# EAGLE design LoadCell-Board (EAGLE 9.6.2)
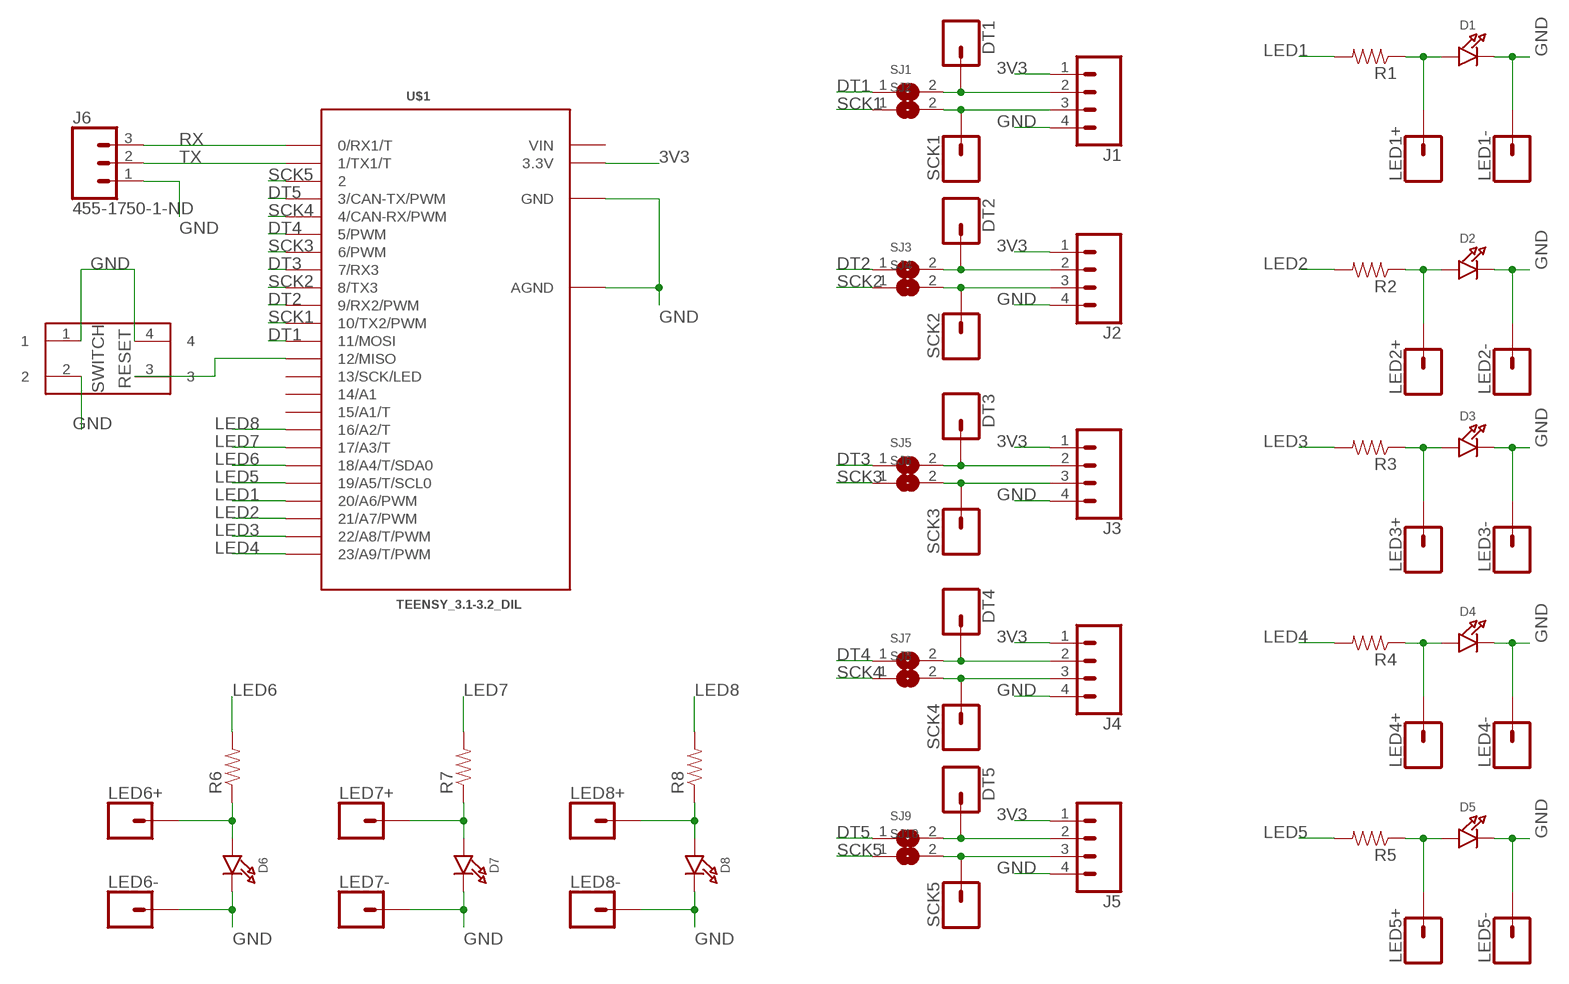
[diagram p0: schematic, sheet 1]

## Parts
D1  MICROBUILDER_LED0603  [MICROBUILDER_CHIPLED_0603]
D2  MICROBUILDER_LED0603  [MICROBUILDER_CHIPLED_0603]
D3  MICROBUILDER_LED0603  [MICROBUILDER_CHIPLED_0603]
D4  MICROBUILDER_LED0603  [MICROBUILDER_CHIPLED_0603]
D5  MICROBUILDER_LED0603  [MICROBUILDER_CHIPLED_0603]
D6  MICROBUILDER_LED0603  [MICROBUILDER_CHIPLED_0603]
D7  MICROBUILDER_LED0603  [MICROBUILDER_CHIPLED_0603]
D8  MICROBUILDER_LED0603  [MICROBUILDER_CHIPLED_0603]
DT1  CONN_01  [1X01]
DT2  CONN_01  [1X01]
DT3  CONN_01  [1X01]
DT4  CONN_01  [1X01]
DT5  CONN_01  [1X01]
J1  CONN_041X04_NO_SILK  [1X04_NO_SILK]
J2  CONN_041X04_NO_SILK  [1X04_NO_SILK]
J3  CONN_041X04_NO_SILK  [1X04_NO_SILK]
J4  CONN_041X04_NO_SILK  [1X04_NO_SILK]
J5  CONN_041X04_NO_SILK  [1X04_NO_SILK]
J6  455-1750-1-ND  CONN_03  [1X03]
LED1+  CONN_01PTH_NO_SILK_YES_STOP  [1X01_NO_SILK]
LED1-  CONN_01PTH_NO_SILK_YES_STOP  [1X01_NO_SILK]
LED2+  CONN_01PTH_NO_SILK_YES_STOP  [1X01_NO_SILK]
LED2-  CONN_01PTH_NO_SILK_YES_STOP  [1X01_NO_SILK]
LED3+  CONN_01PTH_NO_SILK_YES_STOP  [1X01_NO_SILK]
LED3-  CONN_01PTH_NO_SILK_YES_STOP  [1X01_NO_SILK]
LED4+  CONN_01PTH_NO_SILK_YES_STOP  [1X01_NO_SILK]
LED4-  CONN_01PTH_NO_SILK_YES_STOP  [1X01_NO_SILK]
LED5+  CONN_01PTH_NO_SILK_YES_STOP  [1X01_NO_SILK]
LED5-  CONN_01PTH_NO_SILK_YES_STOP  [1X01_NO_SILK]
LED6+  CONN_01PTH_NO_SILK_YES_STOP  [1X01_NO_SILK]
LED6-  CONN_01PTH_NO_SILK_YES_STOP  [1X01_NO_SILK]
LED7+  CONN_01PTH_NO_SILK_YES_STOP  [1X01_NO_SILK]
LED7-  CONN_01PTH_NO_SILK_YES_STOP  [1X01_NO_SILK]
LED8+  CONN_01PTH_NO_SILK_YES_STOP  [1X01_NO_SILK]
LED8-  CONN_01PTH_NO_SILK_YES_STOP  [1X01_NO_SILK]
R1  CONTROLBOARD_V1.0_SPARKFUN_RESISTOR0603-RES  [CONTROLBOARD_V1.0_SPARKFUN_0603-RES]
R2  CONTROLBOARD_V1.0_SPARKFUN_RESISTOR0603-RES  [CONTROLBOARD_V1.0_SPARKFUN_0603-RES]
R3  CONTROLBOARD_V1.0_SPARKFUN_RESISTOR0603-RES  [CONTROLBOARD_V1.0_SPARKFUN_0603-RES]
R4  CONTROLBOARD_V1.0_SPARKFUN_RESISTOR0603-RES  [CONTROLBOARD_V1.0_SPARKFUN_0603-RES]
R5  CONTROLBOARD_V1.0_SPARKFUN_RESISTOR0603-RES  [CONTROLBOARD_V1.0_SPARKFUN_0603-RES]
R6  CONTROLBOARD_V1.0_SPARKFUN_RESISTOR0603-RES  [CONTROLBOARD_V1.0_SPARKFUN_0603-RES]
R7  CONTROLBOARD_V1.0_SPARKFUN_RESISTOR0603-RES  [CONTROLBOARD_V1.0_SPARKFUN_0603-RES]
R8  CONTROLBOARD_V1.0_SPARKFUN_RESISTOR0603-RES  [CONTROLBOARD_V1.0_SPARKFUN_0603-RES]
RESET  SWITCH  431256038716  [431256038716]
SCK1  CONN_01  [1X01]
SCK2  CONN_01  [1X01]
SCK3  CONN_01  [1X01]
SCK4  CONN_01  [1X01]
SCK5  CONN_01  [1X01]
SJ1  MICROBUILDER_SOLDERJUMPERREFLOW_NOPASTE  [MICROBUILDER_SOLDERJUMPER_REFLOW_NOPASTE]
SJ2  MICROBUILDER_SOLDERJUMPERREFLOW_NOPASTE  [MICROBUILDER_SOLDERJUMPER_REFLOW_NOPASTE]
SJ3  MICROBUILDER_SOLDERJUMPERREFLOW_NOPASTE  [MICROBUILDER_SOLDERJUMPER_REFLOW_NOPASTE]
SJ4  MICROBUILDER_SOLDERJUMPERREFLOW_NOPASTE  [MICROBUILDER_SOLDERJUMPER_REFLOW_NOPASTE]
SJ5  MICROBUILDER_SOLDERJUMPERREFLOW_NOPASTE  [MICROBUILDER_SOLDERJUMPER_REFLOW_NOPASTE]
SJ6  MICROBUILDER_SOLDERJUMPERREFLOW_NOPASTE  [MICROBUILDER_SOLDERJUMPER_REFLOW_NOPASTE]
SJ7  MICROBUILDER_SOLDERJUMPERREFLOW_NOPASTE  [MICROBUILDER_SOLDERJUMPER_REFLOW_NOPASTE]
SJ8  MICROBUILDER_SOLDERJUMPERREFLOW_NOPASTE  [MICROBUILDER_SOLDERJUMPER_REFLOW_NOPASTE]
SJ9  MICROBUILDER_SOLDERJUMPERREFLOW_NOPASTE  [MICROBUILDER_SOLDERJUMPER_REFLOW_NOPASTE]
SJ10  MICROBUILDER_SOLDERJUMPERREFLOW_NOPASTE  [MICROBUILDER_SOLDERJUMPER_REFLOW_NOPASTE]
U$1  TEENSY_3.1-3.2_DIL  [TEENSY_3.0-3.2&LC_DIL]

## Nets
3V3: J1.1 J2.1 J3.1 J4.1 J5.1 U$1.3.3V
DT1: SJ1.1 U$1.11(11/MOSI)
DT2: SJ3.1 U$1.9(9/RX2/PWM)
DT3: SJ5.1 U$1.7(7/RX3)
DT4: SJ7.1 U$1.5(5/PWM)
DT5: SJ9.1 U$1.3(3/CAN-TX/PWM)
GND: D1.C D2.C D3.C D4.C D5.C D6.C D7.C D8.C J1.4 J2.4 J3.4 J4.4 J5.4 J6.1 LED1-.1 LED2-.1 LED3-.1 LED4-.1 LED5-.1 LED6-.1 LED7-.1 LED8-.1 RESET.1 RESET.2 RESET.4 U$1.AGND U$1.GND
LED1: R1.2 U$1.20/A6(20/A6/PWM)
LED2: R2.2 U$1.21/A7(21/A7/PWM)
LED3: R3.2 U$1.22/A8(22/A8/T/PWM)
LED4: R4.2 U$1.23/A9(23/A9/T/PWM)
LED5: R5.2 U$1.19/A5(19/A5/T/SCL0)
LED6: R6.2 U$1.18/A4(18/A4/T/SDA0)
LED7: R7.2 U$1.17/A3(17/A3/T)
LED8: R8.2 U$1.16/A2(16/A2/T)
N$1: D1.A LED1+.1 R1.1
N$2: DT1.1 J1.2 SJ1.2
N$3: D2.A LED2+.1 R2.1
N$4: J1.3 SCK1.1 SJ2.2
N$5: D3.A LED3+.1 R3.1
N$6: DT2.1 J2.2 SJ3.2
N$7: RESET.3 U$1.12(12/MISO)
N$8: D4.A LED4+.1 R4.1
N$9: J2.3 SCK2.1 SJ4.2
N$10: D5.A LED5+.1 R5.1
N$11: DT3.1 J3.2 SJ5.2
N$12: D6.A LED6+.1 R6.1
N$13: J3.3 SCK3.1 SJ6.2
N$14: D7.A LED7+.1 R7.1
N$15: DT4.1 J4.2 SJ7.2
N$16: D8.A LED8+.1 R8.1
N$17: J4.3 SCK4.1 SJ8.2
N$39: DT5.1 J5.2 SJ9.2
N$40: J5.3 SCK5.1 SJ10.2
RX: J6.3 U$1.0(0/RX1/T)
SCK1: SJ2.1 U$1.10(10/TX2/PWM)
SCK2: SJ4.1 U$1.8(8/TX3)
SCK3: SJ6.1 U$1.6(6/PWM)
SCK4: SJ8.1 U$1.4(4/CAN-RX/PWM)
SCK5: SJ10.1 U$1.2
TX: J6.2 U$1.1(1/TX1/T)
Unconnected: U$1.13(13/SCK/LED) U$1.14/A0(14/A1) U$1.15/A1(15/A1/T)

## Power pins joined to a net without a drawn wire
VIN: U$1.VIN

## Library data of the parts
D1-D8 = Adafruit Feather M0 Basic rev C:MICROBUILDER_LED: LED 0603 - 0603 Surface Mount Package 2mA: Green LED - Low Power (3.9mcd, 2ma, 1.7Vf) - Digikey: 475-2709-2-ND Orange LED - Low Power (9.8mcd, 2ma, 1.8Vf) - Digikey: 475-1194-2-ND Red LED - Low Power (5mcd, 2ma, 1.8Vf) - Digikey: 475-1195-2-ND Yellow LED - Low Power (7mcd, 2ma, 1.8Vf) - Digikey: 475-1196-2-ND 5mA: Blue LED - Low Power (17mcd, 5ma, 2.9Vf) - Digikey: LNJ937W8CRACT-ND 0805 - 0805 Surface Mount Package 2mA: Red LED (8.8mcd, 2mA, 1.8Vf, Clear) - Low Power [Digikey: 475-2510-1-ND] Green LED (5mcd, 2mA, 1.8Vf, Clear) - Low Power [Digikey: 475-2730-1-ND] Yellow LED (11.3mcd, 2mA, 1.8Vf, Clear) - Low Power [Digikey: 475-2555-1-ND] 20mA: Red LED (104mcd, 20mA, Diffused) - LS R976 [Digikey: 475-1278-6-ND] Red LED (12mcd, 20mA, 2.0Vf, Clear) - APT2012EC [Digikey: 754-1128-1-ND] Green LED (15mcd, 20mA, 2.2Vf, Clear) - APT2012GC [Digikey: 754-1131-1-ND] Orange LED (160mcd, 20mA, 2.1Vf, Clear) - APT2012SECK [Digikey: 754-1130-1-ND] 1206 - 1206 Surface Mount Package Green LED (26mcd, 20mA, Diffused) - LG N971 [Digikey: 475-1407-6-ND] Red LED (15mcd, 20mA, Diffused) - LH N974 [Digikey: 475-1416-6-ND] Cree - Cree High-Power Surface Mount LEDs XPEBWT-L1-0000-00D50 - White 111lm 350mA 2.9Vf 6200K 110° XTEAWT-00-0000-00000LEE3 - White 114lm 350mA 2.85Vf 5000K 115° Everlight - Everlight 45-21 Series Surface Mount LEDs 45-21/QK2C-B2832AC2CB2/2T - Warm White 2000mcd 20mA 3.25Vf 3050K 120° 45-21/LK2C-B38452C4CB2/2T - Nuetral White 2000mcd 20mA 3.25Vf 4150K 120° 45-21/LK2C-B50634C6CB2/2T - Cold White 2200mcd 20mA 3.25Vf 5650K 120° PLCC2 Reverse Mount LS T77K-J1L2-1-0-2-R18-Z - Red 11.25mcd 2mA 1.8Vf 630nm 120° LO T77K-L1M2-24-Z - Orange 19.6mcd 2mA 1.8Vf 606nm 120° LY T77K-K2M1-26-Z - Yellow 15.7mcd 2mA 1.8Vf 587nm 120°
DT1-DT5 LED1+ LED1- LED2+ LED2- LED3+ LED3- LED4+ LED4- LED5+ LED5- LED6+ LED6- LED7+ LED7- LED8+ LED8- SCK1-SCK5 = SparkFun-Connectors:CONN_01: Single connection point. Often used as Generic Header-pin footprint for 0.1 inch spaced/style header connections On any of the 0.1 inch spaced packages, you can populate with these: Break Away Headers - Straight <https://www.sparkfun.com/products/116> (PRT-00116) Break Away Male Headers - Right Angle <https://www.sparkfun.com/products/553> (PRT-00553) Female Headers <https://www.sparkfun.com/products/115> (PRT-00115) Break Away Headers - Machine Pin <https://www.sparkfun.com/products/117> (PRT-00117) Break Away Female Headers - Swiss Machine Pin <https://www.sparkfun.com/products/743> (PRT-00743) This device is also useful as a general connection point to wire up your design to another part of your project. Our various solder wires solder well into these plated through hole pads. Hook-Up Wire - Assortment (Stranded, 22 AWG) <https://www.sparkfun.com/products/11375> (PRT-11375) Hook-Up Wire - Assortment (Solid Core, 22 AWG) <https://www.sparkfun.com/products/11367> (PRT-11367) View the entire wire category on our website here <https://www.sparkfun.com/categories/141> Special notes: SMTSO-256-ET is a "flush mount" nut for a 4-40 screw. We mostly use this on specialty testbeds; it is a nice way to connect hardware to your PCB at an adjustable hieght. Also note, the SNAP packages are for using a snappable style connector. We sell a baggie of snaps and they are also used on two LilyPad designs: Snap Assortment - 30 pack (male and female) <https://www.sparkfun.com/products/11347> (DEV-11347) LilyPad Arduino SimpleSnap <https://www.sparkfun.com/products/10941> (DEV-10941) LilyPad SimpleSnap Protoboard <https://www.sparkfun.com/products/10940> (DEV-10940)
J1-J5 = SparkFun-Connectors:CONN_04: Multi connection point. Often used as Generic Header-pin footprint for 0.1 inch spaced/style header connections On any of the 0.1 inch spaced packages, you can populate with these: Break Away Headers - Straight <https://www.sparkfun.com/products/116> (PRT-00116) Break Away Male Headers - Right Angle <https://www.sparkfun.com/products/553> (PRT-00553) Female Headers <https://www.sparkfun.com/products/115> (PRT-00115) Break Away Headers - Machine Pin <https://www.sparkfun.com/products/117> (PRT-00117) Break Away Female Headers - Swiss Machine Pin <https://www.sparkfun.com/products/743> (PRT-00743) For SCREWTERMINALS and SPRING TERMINALS visit here: Screw Terimnals on SparkFun.com <https://www.sparkfun.com/search/results?term=Screw+Terminals> (5mm/3.5mm/2.54mm spacing) This device is also useful as a general connection point to wire up your design to another part of your project. Our various solder wires solder well into these plated through hole pads. Hook-Up Wire - Assortment (Stranded, 22 AWG) <https://www.sparkfun.com/products/11375> (PRT-11375) Hook-Up Wire - Assortment (Solid Core, 22 AWG) <https://www.sparkfun.com/products/11367> (PRT-11367) View the entire wire category on our website here <https://www.sparkfun.com/categories/141> Special notes: Molex polarized connector foot print use with SKU : PRT-08231 with associated crimp pins and housings. 1MM SMD Version SKU: PRT-10208; PROD_ID: CONN-09696
J6 = SparkFun-Connectors:CONN_03: Multi connection point. Often used as Generic Header-pin footprint for 0.1 inch spaced/style header connections On any of the 0.1 inch spaced packages, you can populate with these: Break Away Headers - Straight <https://www.sparkfun.com/products/116> (PRT-00116) Break Away Male Headers - Right Angle <https://www.sparkfun.com/products/553> (PRT-00553) Female Headers <https://www.sparkfun.com/products/115> (PRT-00115) Break Away Headers - Machine Pin <https://www.sparkfun.com/products/117> (PRT-00117) Break Away Female Headers - Swiss Machine Pin <https://www.sparkfun.com/products/743> (PRT-00743) Stackable Header - 3 Pin (Female, 0.1") <https://www.sparkfun.com/products/13875> (PRT-13875) For SCREWTERMINALS and SPRING TERMINALS visit here: Screw Terimnals on SparkFun.com <https://www.sparkfun.com/search/results?term=Screw+Terminals> (5mm/3.5mm/2.54mm spacing) This device is also useful as a general connection point to wire up your design to another part of your project. Our various solder wires solder well into these plated through hole pads. Hook-Up Wire - Assortment (Stranded, 22 AWG) <https://www.sparkfun.com/products/11375> (PRT-11375) Hook-Up Wire - Assortment (Solid Core, 22 AWG) <https://www.sparkfun.com/products/11367> (PRT-11367) View the entire wire category on our website here <https://www.sparkfun.com/categories/141> Special notes: Molex polarized connector foot print use with SKU : PRT-08232 with associated crimp pins and housings.; PROD_ID: XXX-00000
R1-R8 = Lighting_Controller_1.1:CONTROLBOARD_V1.0_SPARKFUN_RESISTOR: Resistor Basic schematic elements and footprints for 0603, 1206, and PTH resistors.
RESET = Wurth_Elektronik_Electromechanic_Switch_rev15e:431256038716: WS-TST, 6*6mm right angle Tact switch,THT, height 3.85mm, 4 pins, black actuator, 160gf
SJ1-SJ10 = Adafruit NeoTrellis 4x4:MICROBUILDER_SOLDERJUMPER: SMD Solder JUMPER Solder the two pads together to create a connection, or remove the solder to break it. REFLOW - Use this footprint for solder paste and reflow ovens. WAVE - Use this footprint for hand-soldering (larger pads). CLOSED - Has a trace between the two pads to ensure it is closed by default. The trace needs to be cut to disable the jumper, and can be closed again by creating a solder bridge between the two pads.
U$1 = Teensy_3_and_LC_Series_Boards_v1.4:TEENSY_3.1-3.2_DIL: Teensy 3.1 or 3.2 in a DIL Layout.

## Board
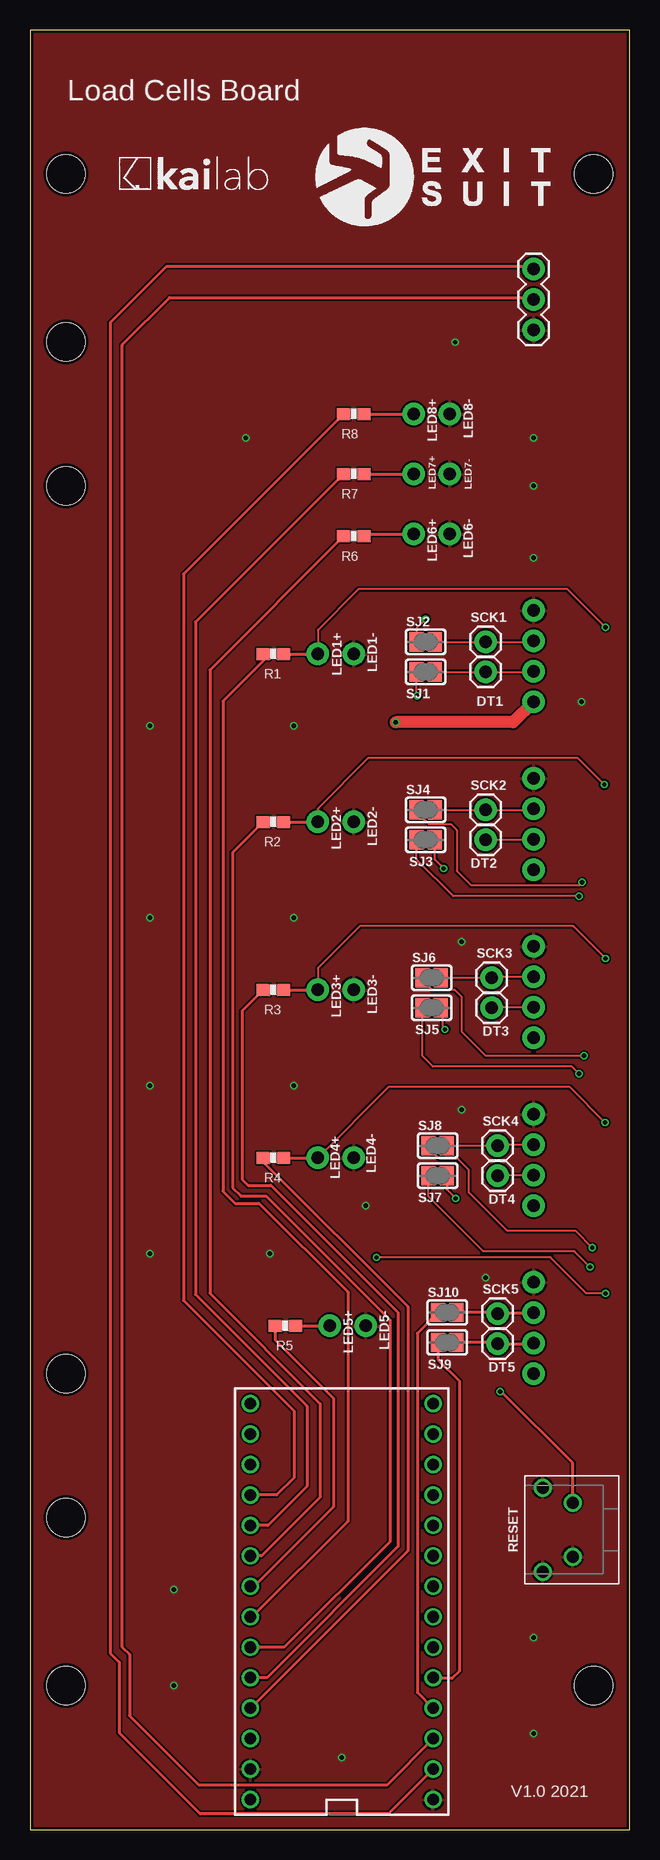
[diagram p1: board, top side]
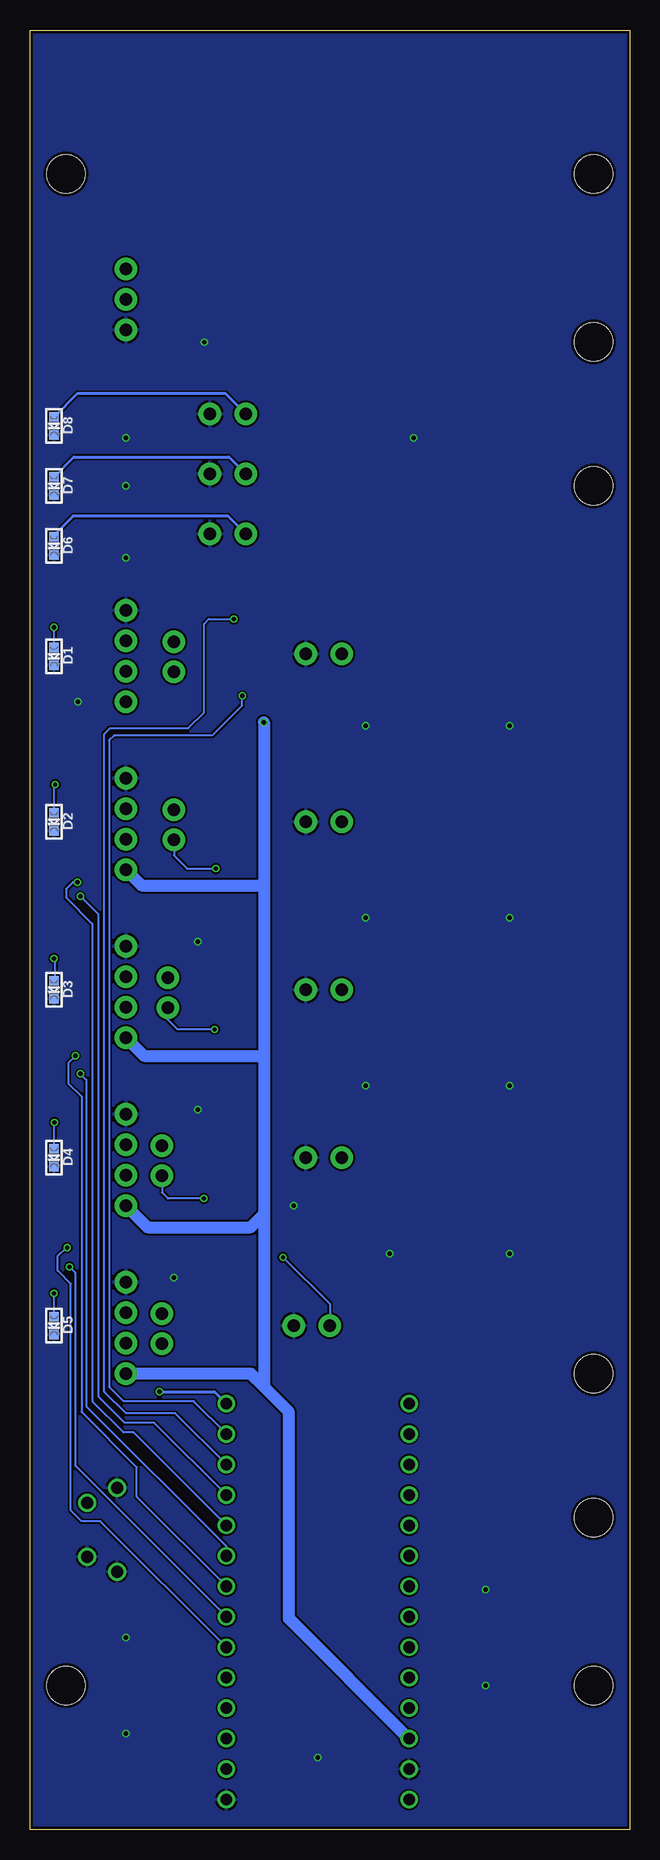
[diagram p2: board, bottom side, seen from below]

Size 50 x 150 mm. Coordinates in mm from the lower left corner, seen from the top.
Outline: 0,0 50,0 50,150 0,150 0,0
Copper layers (1*16): Top 0.018mm / dielectric 1.55mm / Bottom 0.018mm
Design rules "eC_2Layer_PClass6_BaseCopperO18_eCDefault": minimum track width 0.15mm, minimum drill 0.35mm, track to track 0.15mm, track to pad 0.15mm, pad to pad 0.15mm, via to via 0.15mm, smd to smd 0mil, copper to edge 0.25mm, drill to drill 0.35mm, minimum pad ring 0.175mm, minimum via ring 0.125mm, stop-mask expansion 0mil, vias tented up to drill 0.45mm, thermal gap 0.2mm
Holes 3.2 mm at 47,12 47,138 3,138 3,12 3,124 3,112 3,26 3,38

### Footprints (pad centres in the part's own frame; a part is rotated, then mirrored left to right if it is on the bottom)
MICROBUILDER_CHIPLED_0603 = smd 0.8 x 0.8: A 0,-0.75; C 0,0.75
1X01 = drill 1.016 pad 1.88: 1 0,0
1X04_NO_SILK = drill 1.016 pad 1.88: 1 0,0; 2 2.54,0; 3 5.08,0; 4 7.62,0
1X03 = drill 1.016 pad 1.88: 1 0,0; 2 2.54,0; 3 5.08,0
1X01_NO_SILK = drill 1.016 pad 1.88: 1 0,0
CONTROLBOARD_V1.0_SPARKFUN_0603-RES = smd 1.1 x 1: 1 -0.85,0; 2 0.85,0
431256038716 = drill 1: 1 -3.5,1.25; 2 -2.25,-1.25; 3 2.25,-1.25; 4 3.5,1.25
MICROBUILDER_SOLDERJUMPER_REFLOW_NOPASTE = smd 1.168 x 1.6: 1 -0.762,0; 2 0.762,0
TEENSY_3.0-3.2&LC_DIL = drill 0.965: 0 -7.62,13.97; 1 -7.62,11.43; 2 -7.62,8.89; 3 -7.62,6.35; 3.3V 7.62,11.43; 4 -7.62,3.81; 5 -7.62,1.27; 6 -7.62,-1.27; 7 -7.62,-3.81; 8 -7.62,-6.35; 9 -7.62,-8.89; 10 -7.62,-11.43; 11 -7.62,-13.97; 12 -7.62,-16.51; 13 7.62,-16.51; 14/A0 7.62,-13.97; 15/A1 7.62,-11.43; 16/A2 7.62,-8.89; 17/A3 7.62,-6.35; 18/A4 7.62,-3.81; 19/A5 7.62,-1.27; 20/A6 7.62,1.27; 21/A7 7.62,3.81; 22/A8 7.62,6.35; 23/A9 7.62,8.89; AGND 7.62,13.97; GND -7.62,16.51; VIN 7.62,16.51

### Placement (x,y rotation side)
D1  48,97.8 180 bottom
D2  48,84 180 bottom
D3  48,70 180 bottom
D4  48,56 180 bottom
D5  48,42 180 bottom
D6  48,107 180 bottom
D7  48,112 180 bottom
D8  48,117 180 bottom
DT1  38,96.5 0 top
DT2  38,82.5 0 top
DT3  38.5,68.5 0 top
DT4  39,54.5 0 top
DT5  39,40.5 0 top
J1  42,94 90 top
J2  42,80 90 top
J3  42,66 90 top
J4  42,52 90 top
J5  42,38 90 top
J6  42,125 90 top
LED1+  24,98 270 top
LED1-  27,98 270 top
LED2+  24,84 270 top
LED2-  27,84 270 top
LED3+  24,70 270 top
LED3-  27,70 270 top
LED4+  24,56 0 top
LED4-  27,56 0 top
LED5+  25,42 270 top
LED5-  28,42 270 top
LED6+  32,108 270 top
LED6-  35,108 270 top
LED7+  32,113 0 top
LED7-  35,113 0 top
LED8+  32,118 180 top
LED8-  35,118 180 top
R1  20.3,98 180 top
R2  20.3,84 180 top
R3  20.3,70 180 top
R4  20.3,56 180 top
R5  21.3,42 180 top
R6  27,107.8 180 top
R7  27,113 180 top
R8  27,118 180 top
RESET  44,25 90 top
SCK1  38,99 0 top
SCK2  38,85 0 top
SCK3  38.5,71 0 top
SCK4  39,57 0 top
SCK5  39,43 0 top
SJ1  33,96.5 0 top
SJ2  33,99 0 top
SJ3  33,82.5 0 top
SJ4  33,85 0 top
SJ5  33.5,68.5 0 top
SJ6  33.5,71 0 top
SJ7  34,54.5 0 top
SJ8  34,57 0 top
SJ9  34.8,40.6 0 top
SJ10  34.8,43.1 0 top
U$1  26,19 180 top

### Tracks (layer width: path | path; a pad name or v marks a point on that pad's centre or on a via)
3V3  (via drill 0.35)
  Top 1.016: J1.1 40.3,92.3 v30.5,92.3
  Bottom 1.016: U$1.3.3V 28.4,17.59 28.4,34.8 30.5,36.9 | J5.1 31.6,38 30.5,36.9 | v30.5,92.3 30.5,78.7 | 30.5,78.7 30.5,64.5 | 30.5,64.5 30.5,51.3 | 30.5,51.3 30.5,36.9 | 30.5,51.3 31.6,50.2 40.2,50.2 J4.1 | J3.1 40.5,64.5 30.5,64.5 | J2.1 40.7,78.7 30.5,78.7
DT1  (via drill 0.35)
  Top 0.152: v32.3,94.5 32.24,94.56 SJ1.1
  Bottom 0.152: U$1.11 36.35,35.7 42.2,35.7 43.4,36.9 43.4,90.8 43,91.2 34.8,91.2 32.3,93.7 v32.3,94.5
DT2  (via drill 0.35)
  Top 0.152: v45.8,77.8 35.3,77.8 32.24,80.86 SJ3.1
  Bottom 0.152: U$1.9 39.63,33.9 42.1,33.9 44.3,36.1 44.3,76.3 v45.8,77.8
DT3  (via drill 0.35)
  Top 0.152: v45.8,63 45.2,63.6 33.6,63.6 32.74,64.46 SJ5.1
  Bottom 0.152: U$1.7 33.62,23.61 45.3,35.29 45.3,62.5 v45.8,63
DT4  (via drill 0.35)
  Top 0.152: v46.71,46.9 45.41,48.2 37.8,48.2 33.24,52.76 SJ7.1
  Bottom 0.152: U$1.5 46.2,30.31 46.2,46.4 v46.7,46.9 v46.71,46.9
DT5
  Top 0.254: SJ9.1 34.04,39.16 35.8,37.4 35.8,13.2 35.2,12.6 33.67,12.6 U$1.3
GND  (via drill 0.35)
  other vias: 18,116 42,116 42,112 42,106 10,92 22,92 46,94 10,76 22,76 10,62 22,62 10,48 20,48 12,20 28,52 36,60 38,46 36,74 42,16 42,8 26,6 12,12 35.45,123.97
  pour Top: 0,150 50,150 50,0 0,0
  pour Bottom: 0,150 50,150 50,0 0,0
LED1
  Top 0.254: R1.2 19.45,97.4 16.1,94.05 16.1,53.2 17.1,52.2 19.1,52.2 26.5,44.8 26.5,25.7 18.53,17.73 U$1.20/A6
LED2
  Top 0.254: R2.2 16.9,81.45 16.9,53.5 17.6,52.8 19.7,52.8 30,42.5 30,24 21.19,15.19 U$1.21/A7
LED3
  Top 0.254: R3.2 17.7,68.25 17.7,54.2 18.2,53.7 20.1,53.7 30.7,43.1 30.7,23.6 19.75,12.65 U$1.22/A8
LED4
  Top 0.254: R4.2 19.45,55.65 31.5,43.6 31.5,23.23 U$1.23/A9
LED5
  Top 0.254: R5.2 20.45,40.8 25.3,35.95 25.3,26.9 18.67,20.27 U$1.19/A5
LED6
  Top 0.254: R6.2 15,96.65 15,44.7 24.2,35.5 24.2,27.7 19.31,22.81 U$1.18/A4
LED7
  Top 0.254: R7.2 13.8,100.65 13.8,44.6 23.1,35.3 23.1,28.6 19.85,25.35 U$1.17/A3
LED8
  Top 0.254: R8.2 12.8,104.65 12.8,44.1 22,34.9 22,29.31 20.58,27.89 U$1.16/A2
N$1  (via drill 0.35)
  Top 0.152: v48,100.2 44.8,103.4 27.4,103.4 24,100 LED1+.1
  Top 0.254: R1.1 LED1+.1
  Bottom 0.152: D1.A v48,100.2
N$2
  Top 0.152: SJ1.2 DT1.1 41.96,96.5 J1.2
N$3  (via drill 0.35)
  Top 0.152: v47.9,87.1 45.7,89.3 28.2,89.3 24,85.1 LED2+.1
  Top 0.254: R2.1 LED2+.1
  Bottom 0.152: D2.A 48,87.1 v47.9,87.1
N$4
  Top 0.152: SJ2.2 SCK1.1 41.92,99 J1.3
N$5  (via drill 0.35)
  Top 0.152: v48,72.6 45.3,75.3 27.5,75.3 24,71.8 LED3+.1
  Top 0.254: R3.1 LED3+.1
  Bottom 0.152: D3.A 47.9,70.85 47.9,72.5 v48,72.6
N$6  (via drill 0.35)
  Top 0.152: J2.2 41.96,82.5 DT2.1 | v34.5,80.1 33.76,80.84 SJ3.2
  Bottom 0.152: DT2.1 38,81.2 36.9,80.1 v34.5,80.1
N$7  (via drill 0.35)
  Top 0.254: RESET.3 45.25,30.55 39.3,36.5 v39.2,36.5
  Bottom 0.254: v39.2,36.5 34.61,36.5 U$1.12
N$8  (via drill 0.35)
  Top 0.152: v47.95,58.95 45,61.9 29.9,61.9 LED4+.1
  Top 0.254: R4.1 LED4+.1
  Bottom 0.152: D4.A 48,58.8 47.9,58.9 v47.95,58.95
N$9
  Top 0.152: SJ4.2 SCK2.1 41.92,85 J2.3
N$10  (via drill 0.35)
  Top 0.152: v48,44.7 46.4,44.7 43.4,47.7 v28.9,47.7
  Top 0.254: R5.1 LED5+.1
  Bottom 0.152: D5.A v48,44.7 | v28.9,47.7 25,43.8 LED5+.1
N$11  (via drill 0.35)
  Top 0.152: J3.2 38.54,68.54 DT3.1 | SJ5.2 34.4,68.36 34.4,66.9 v34.6,66.7
  Bottom 0.152: v34.6,66.7 37.7,66.7 38.5,67.5 DT3.1
N$12
  Top 0.254: R6.1 28.05,108 LED6+.1
  Bottom 0.254: LED6+.1 33.5,109.5 46.4,109.5 48,107.9 D6.A
N$13
  Top 0.152: J3.3 38.58,71.08 SCK3.1 SJ6.2
N$14
  Top 0.254: R7.1 LED7+.1
  Bottom 0.254: D7.A 46.35,114.4 33.4,114.4 LED7+.1
N$15  (via drill 0.35)
  Top 0.152: J4.2 39.04,54.54 DT4.1 | SJ7.2 34.76,53.34 v35.5,52.6
  Bottom 0.152: DT4.1 39,53.1 38.5,52.6 v35.5,52.6
N$16
  Top 0.254: R8.1 LED8+.1
  Bottom 0.254: LED8+.1 33.7,119.7 46.05,119.7 D8.A
N$17
  Top 0.152: J4.3 39.08,57.08 SCK4.1 SJ8.2
N$39
  Top 0.254: SJ9.2 38.9,40.6 DT5.1 41.96,40.5 J5.2
N$40
  Top 0.254: SJ10.2 38.9,43.1 SCK5.1 39.08,43.08 J5.3
RX
  Top 0.254: U$1.0 29.89,1.3 14.2,1.3 7.45,8.05 7.45,13.95 6.7,14.7 6.7,125.6 11.4,130.3 41.78,130.3 J6.3
SCK1  (via drill 0.35)
  Top 0.152: v33,100.9 32.24,100.14 SJ2.1
  Bottom 0.152: U$1.10 37.89,34.7 42,34.7 43.8,36.5 43.8,91.3 43.3,91.8 36.8,91.8 35.5,93.1 35.5,100.5 35.1,100.9 v33,100.9
SCK2  (via drill 0.35)
  Top 0.152: v46.05,78.95 45.8,78.7 36.8,78.7 35.6,79.9 35.6,83.3 35.1,83.8 33.25,83.8 32.95,84.11 32.95,84.29 SJ4.1
  Bottom 0.152: U$1.8 41.37,33.1 42.2,33.1 44.8,35.7 44.8,75.5 47,77.7 47,78.4 46.45,78.95 v46.05,78.95
SCK3  (via drill 0.35)
  Top 0.152: v46.2,64.5 38,64.5 36,66.5 36,69.4 35.43,69.97 33.58,69.97 32.74,70.82 SJ6.1
  Bottom 0.152: U$1.6 41.1,27.75 41.1,30.2 45.7,34.8 45.7,61.1 46.8,62.2 46.8,63.9 v46.2,64.5
SCK4  (via drill 0.35)
  Top 0.152: v46.9,48.5 45.5,49.9 39.8,49.9 36.6,53.1 36.6,55 35.7,55.9 34.2,55.9 34.13,55.97 34.08,55.97 33.24,56.82 SJ8.1
  Bottom 0.152: U$1.4 44.13,25.7 45.7,25.7 46.6,26.6 46.6,45.5 47.7,46.6 47.7,47.8 47,48.5 v46.9,48.5
SCK5
  Top 0.254: SJ10.1 32.3,41.37 32.3,11.43 U$1.2
TX
  Top 0.254: U$1.1 29.76,3.71 14.09,3.71 8.3,9.5 8.3,14.6 7.7,15.2 7.7,123.77 11.63,127.7 41.84,127.7 J6.2

### Text on the board
tPlace: Load Cells Board | V1.0 2021 | /Users/kailab/Google Drive/Kai Lab/04 - ENGINEERING/07 - ELECTRONICS DESIGN/03 - EAGLE BMP/logo_&_type.bmp